# EasyEDA Pro project ProPrj_有源滤波器_2025-07-17.epro

# Schematic Schematic1
Board Name: Board1; Create Date: 2025-07-17; Page Name: P1; Project Name: 有源滤波器; Schematic Name: Schematic1; Update Date: 2025-07-17; Company: 嘉立创EDA; Page Size: A4; Version: V1.0
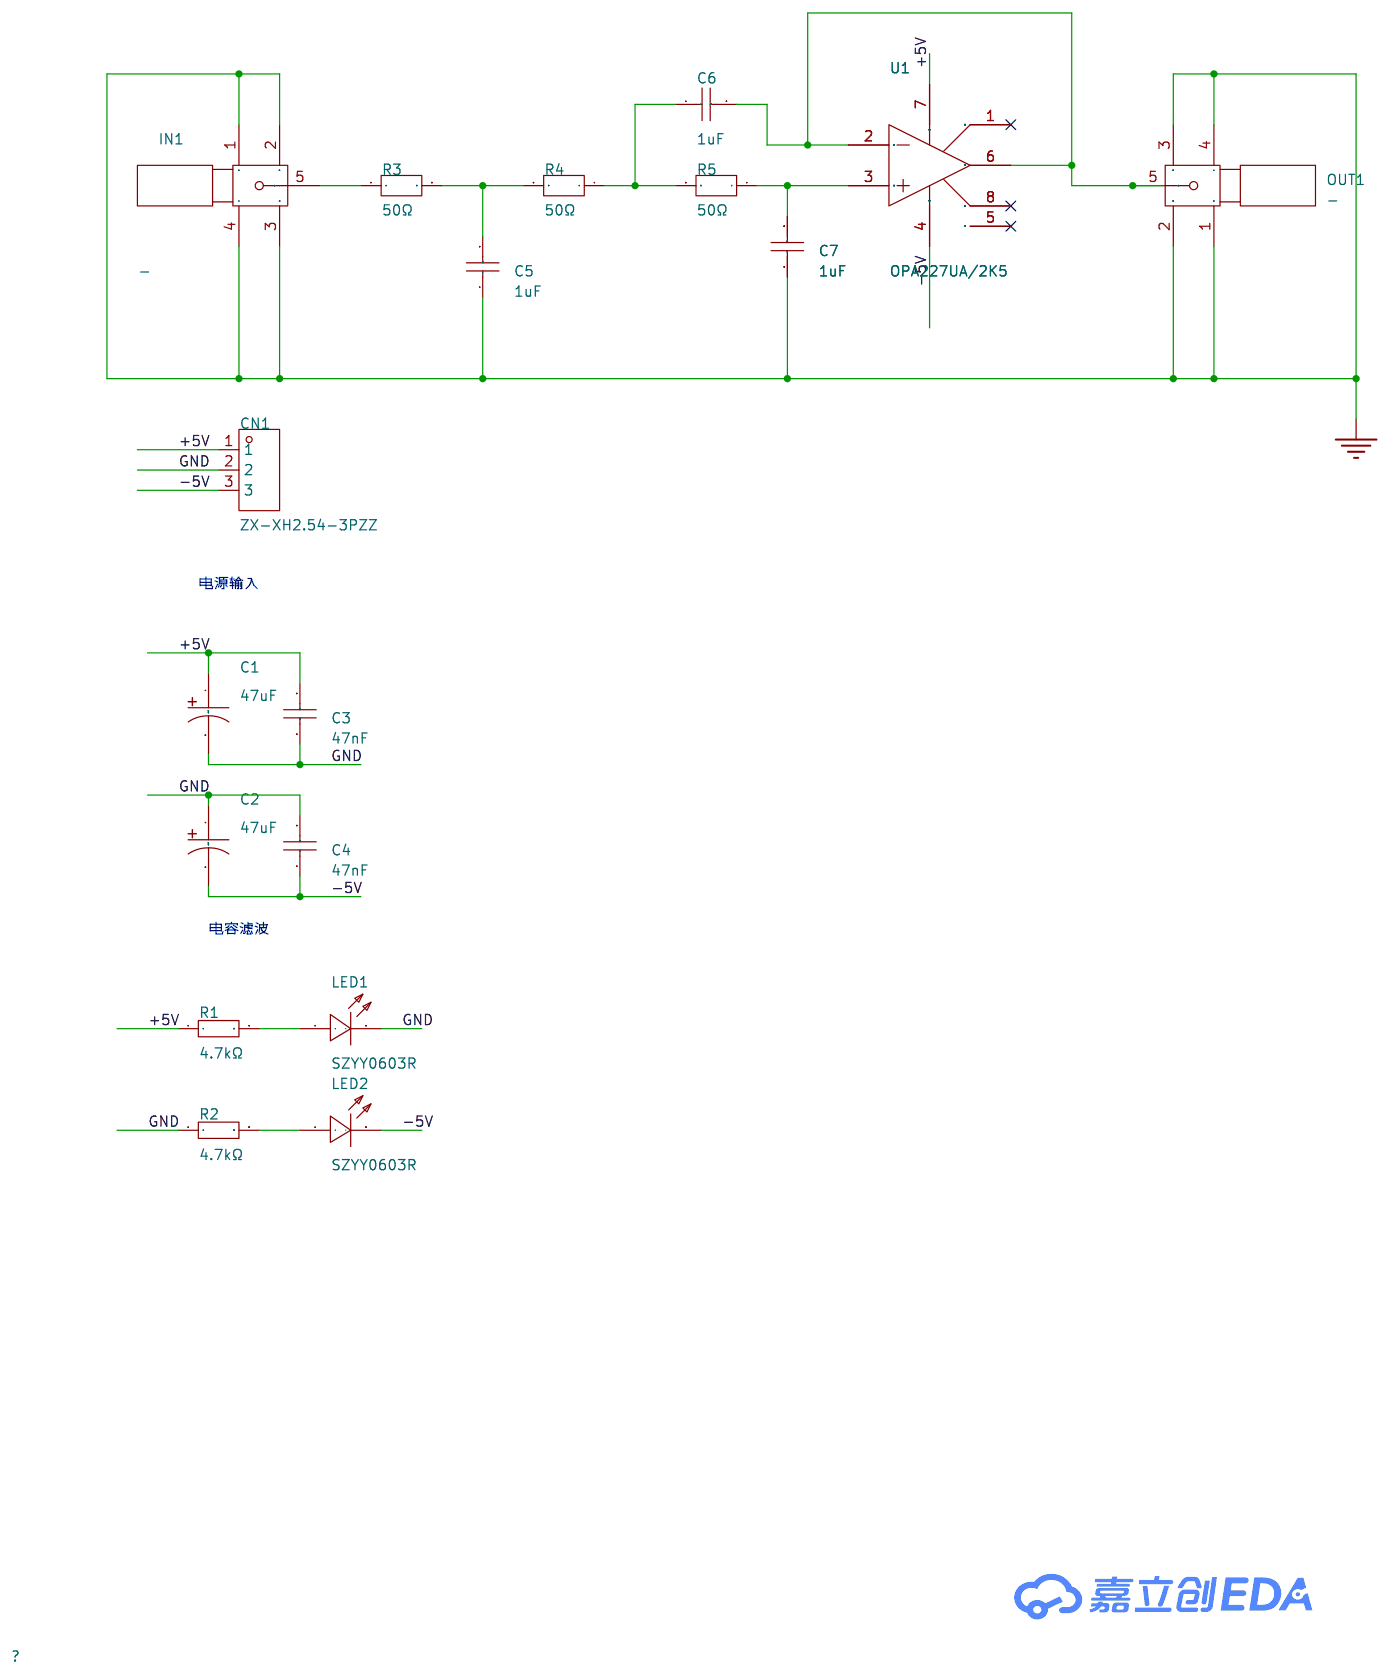
[diagram p0: schematic sheet]

## Parts
C1  47uF  [CAP-TH_BD5.0-P2.00-D0.8-FD]
C2  47uF  [CAP-TH_BD5.0-P2.00-D0.8-FD]
C3  47nF  [C0805]
C4  47nF  [C0805]
C5  1uF  [C0805]
C6  1uF  [C0805]
C7  1uF  [C0805]
CN1  ZX-XH2.54-3PZZ  [CONN-TH_3P-P2.54_2501S-3P]
IN1  -  [SMA-SMD_BWSMA-KE-P001]
LED1  SZYY0603R  [LED0603-R-RD]
LED2  SZYY0603R  [LED0603-R-RD]
OUT1  -  [SMA-SMD_BWSMA-KE-P001]
R1  4.7kΩ  [R0805]
R2  4.7kΩ  [R0805]
R3  50Ω  [R0805]
R4  50Ω  [R0805]
R5  50Ω  [R0805]
U1  OPA227UA/2K5  [SOIC-8_L4.9-W3.9-P1.27-LS6.0-BL]

## Library data of the parts
C1 C2 = NXB25V47M5*11 2.5TP: 容值:47uF;精度:±20%;额定电压:25V;纹波电流:250mA@100kHz;等效串联电阻(ESR):300mΩ@100kHz;; LCSC Part Name: 47uF ±20% 25V; Supplier Part: C371230; Manufacturer: SAMYOUNG(韩国三莹); Supplier Footprint: 插件,D5xL11mm; JLCPCB Part Class: 扩展库; Datasheet: https://atta.szlcsc.com/upload/public/pdf/source/20190227/C371244_FA85FFEFC2961227CF12E3CCE8C34A7D.pdf; Supplier: LCSC; Tolerance: ±20%; Voltage Rating: 25V; Ripple Current: 250mA@100kHz; Equivalent Series Resistance(ESR): 300mΩ@100kHz; Pin Spacing: 2mm; Diameter: 5mm; Height - Seated (Max): 11mm; Lifetime: 2000hrs@105℃; Operating Temperature: -40℃~+105℃
C3 C4 = CL21B473KBCNNNC: 容值:47nF;精度:±10%;额定电压:50V;材质(温度系数):X7R;; LCSC Part Name: 47nF ±10% 50V; Supplier Part: C53134; Manufacturer: SAMSUNG(三星); Supplier Footprint: 0805; JLCPCB Part Class: 基础库; Datasheet: https://atta.szlcsc.com/upload/public/pdf/source/20160218/1457707763339.pdf; Supplier: LCSC; Tolerance: ±10%; Voltage Rated: 50V; Temperature Coefficient: X7R
C5-C7 = CL21B105KBFNNNE: 容值:1uF;精度:±10%;额定电压:50V;材质(温度系数):X7R;; LCSC Part Name: 1uF ±10% 50V; Supplier Part: C28323; Manufacturer: SAMSUNG(三星); Supplier Footprint: 0805; JLCPCB Part Class: 基础库; Datasheet: https://atta.szlcsc.com/upload/public/pdf/source/20160218/1457707763339.pdf; Supplier: LCSC; Tolerance: ±10%; Voltage Rated: 50V; Temperature Coefficient: X7R
CN1 = ZX-XH2.54-3PZZ: 插针结构:1x3P;间距:2.5mm;安装方式:直插;参考系列:XH;总PIN数:3P;排数:1;每排PIN数:3;行距:-;额定电流:3A;触头材质:黄铜;触头镀层:锡;工作温度范围:-25℃~+85℃;; LCSC Part Name: 1x3P 间距:2.5mm 直插 系列:XH; Supplier Part: C7429633; Manufacturer: Megastar(兆星); Supplier Footprint: 插件,P=2.5mm; JLCPCB Part Class: 扩展库; Datasheet: https://atta.szlcsc.com/upload/public/pdf/source/20230619/AE17037A2CFDBE8D9CBA775D61AD0A84.pdf; Supplier: LCSC; Pins Structure: 1x3P; Pitch: 2.5mm; Mounting Type: 直插; Reference Series: XH; Number of Pins: 3P; Number of Rows: 1; Number of PINs Per Row: 3; Rated Current: 3A; Contact Material: 黄铜; Contact Plating: 锡; Operating Temperature: -25℃~+85℃; Rated Voltage (Max): 250V; Plastic Material: PA66; Flame Retardant Rating: UL94V-0; Color: 白色; Z-Height of the Board: 7mm; X-Length of Bottom Edge on Board (Spacing Line): 10mm; Y-Width of Bottom Edge on Board: 5.9mm
IN1 OUT1 = BWSMA-KE-P001: 连接器类型:板端;接口类型:内孔;端口数量:1;接口直径:5.2mm;接口长度/高度:-;频率:-;射频系列:SMA;阻抗:50Ω;样式:偏脚;工作温度:-;; LCSC Part Name: 内孔 SMA 偏脚; Supplier Part: C496550; Manufacturer: BAT WIRELESS(蝙蝠无线); Supplier Footprint: SMD; JLCPCB Part Class: 扩展库; Datasheet: https://atta.szlcsc.com/upload/public/pdf/source/20240320/28FD502871C976DFF213ABFCF2A0ED51.pdf; Supplier: LCSC; Connector Type: 板端; Interface: 内孔; Number of Ports: 1; Interface Diameter: 5.2mm; RF Series: SMA; Impedance: 50Ω; Style: 偏脚
LED1 LED2 = SZYY0603R: 发光颜色:红色;功率:40mW;正向电流:20mA;主波长:615nm~630nm;二极管配置:-;透镜颜色:无色透明透镜;色温:-;发光角度:120°;载带方式:-;工作温度:-40℃~+85℃;; LCSC Part Name: 红灯; Supplier Part: C434419; Manufacturer: yongyu(永裕光电); Supplier Footprint: 0603; JLCPCB Part Class: 扩展库; Datasheet: https://atta.szlcsc.com/upload/public/pdf/source/20191204/C434419_0B955C1F73FF88449D9A795B6FF49070.pdf; Supplier: LCSC; Emitted Color: 红色; Power Dissipation: 40mW; Forward Current: 20mA; Dominant Wavelength: 615nm~630nm; Peak Wavelength: 645nm; Lens Color: 无色透明透镜; Viewing Angle: 120°; Operating Temperature: -40℃~+85℃
R1 R2 = 0805W8F4701T5E: 电阻类型:厚膜电阻;阻值:4.7kΩ;精度:±1%;功率:125mW;最大工作电压:150V;温度系数:±100ppm/℃;; LCSC Part Name: 4.7kΩ ±1% 125mW 厚膜电阻; Supplier Part: C17673; Manufacturer: UNI-ROYAL(厚声); Supplier Footprint: 0805; JLCPCB Part Class: 基础库; Datasheet: https://atta.szlcsc.com/upload/public/pdf/source/20200306/C422600_1E6D84923E4A46A82E41ADD87F860B5C.pdf; Supplier: LCSC; Type: 厚膜电阻; Tolerance: ±1%; Power(Watts): 125mW; Overload Voltage (Max): 150V; Temperature Coefficient: ±100ppm/℃; Operating Temperature Range: -55℃~+155℃
R3-R5 = TD05G50R0BT: 电阻类型:薄膜电阻;阻值:50Ω;精度:±0.1%;功率:100mW;温度系数:±25ppm/℃;; LCSC Part Name: 薄膜电阻 50Ω ±0.1% 100mW; Supplier Part: C5355206; Manufacturer: FH(风华); Supplier Footprint: 0805; JLCPCB Part Class: 扩展库; Datasheet: https://atta.szlcsc.com/upload/public/pdf/source/20220726/97950D08E3EA8CC4F1F63A0C564F66E4.pdf; Supplier: LCSC; Type: 薄膜电阻; Tolerance: ±0.1%; Power(Watts): 100mW; Temperature Coefficient: ±25ppm/℃
U1 = OPA227UA/2K5: 放大器数:单路;增益带宽积(GBP):8MHz;输入偏置电流(Ib):2.5nA;压摆率(SR):2.3V/us;轨到轨:-;; Supplier Part: C456278; Manufacturer: TI(德州仪器); Supplier Footprint: SOIC-8; JLCPCB Part Class: 扩展库; Datasheet: https://www.ti.com/cn/lit/gpn/opa227; Supplier: LCSC; Number of Channels: 单路; Gain Bandwidth Product: 8MHz; Ib - Input Bias Current: 2.5nA; Slew Rate: 2.3V/us; Output Current: 45mA; Operating Temperature: -40℃~+85℃

## Nets
+5V: C1.1 C3.2 CN1.1 R1.1 U1.7(VCC)
-5V: C2.2 C4.1 CN1.3 LED2.2(-) U1.4(VSS)
GND: C1.2 C2.1 C3.1 C4.2 C5.1 C7.1 CN1.2 IN1.1 IN1.2 IN1.3 IN1.4 LED1.2(-) OUT1.1 OUT1.2 OUT1.3 OUT1.4 R2.1
$1N579: C5.2 R3.2 R4.2
$1N647: C6.1 R4.1 R5.2
$1N1236: LED1.1(+) R1.2
$1N1237: LED2.1(+) R2.2
Net-(C6-2): C6.2 OUT1.5 U1.2(VIN-) U1.6(OUT)
Net-(C7-2): C7.2 R5.1 U1.3(VIN+)
Net-(IN1-5): IN1.5 R3.1

Not connected (* = marked no-connect by the designer): U1 1(TRIM)* 5(NC)* 8(TRIM)*

## Notes on the sheet
- 电源输入
- 电容滤波

# Board PCB1
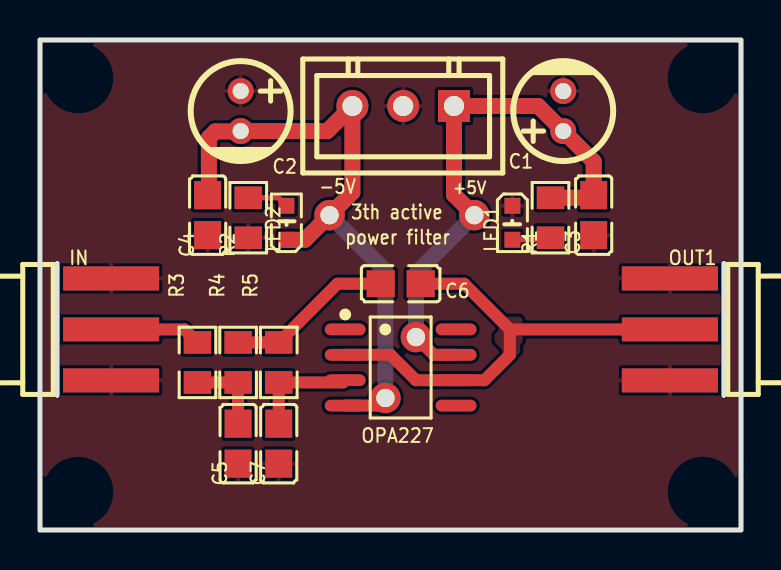
[diagram p1: board, top side]
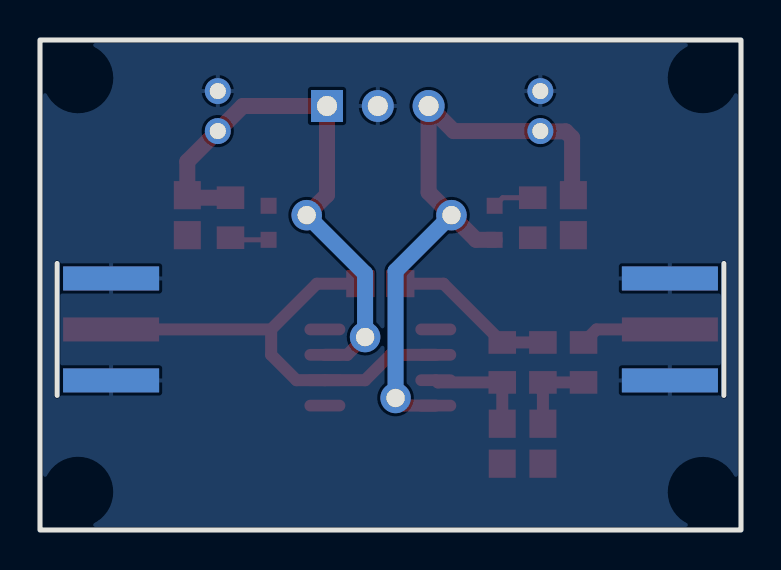
[diagram p2: board, bottom side, seen from below]

Outline 35.05 x 24.51 mm; copper layers: Top Layer, Bottom Layer. Coordinates in mm from the lower left corner of the outline.
Outline path: rectangle 0,24.51 35.05,0
Stack: Top Layer 0.035mm / Dielectric1 1.51mm FR4 er 4.5 / Bottom Layer 0.035mm

## Design rules (mm)
template: JLCPCB Capability(Two Layers Board)
spacing copperThickness1oz (default): track to track 0.102, other pairs 0.152 to 0.3
spacing copperThickness2oz: track to track 0.203, other pairs 0.152 to 0.3
track width copperThickness1oz (default): min 0.127, default 0.254, max 2.54
track width copperThickness2oz: min 0.203, default 0.254, max 2.54
differential pair differentialPair (default): width min 0.127, default 0.254, max 2.54; gap min 0.152, default 0.152
via viaSize (default): diameter min 0.5, default 0.61, max 10; hole min 0.3, default 0.305, max 6.3

## Placement (name value [footprint] x y rotation side)
+5V  ZX-XH2.54-3PZZ  [CONN-TH_3P-P2.54_2501S-3P]  18.16 21.21 180 top
C1  47uF  [CAP-TH_BD5.0-P2.00-D0.8-FD]  26.16 20.95 90 top
C2  47uF  [CAP-TH_BD5.0-P2.00-D0.8-FD]  10.03 20.95 270 top
C3  47nF  [C0805]  27.69 15.75 90 top
C4  47nF  [C0805]  8.38 15.75 270 top
C5  1uF  [C0805]  9.91 4.32 90 top
C6  1uF  [C0805]  18.03 12.32 0 top
C7  1uF  [C0805]  11.94 4.32 90 top
IN  -  [SMA-SMD_BWSMA-KE-P001]  3.56 10.03 180 top
LED1  SZYY0603R  [LED0603-R-RD]  23.62 15.37 270 top
LED2  SZYY0603R  [LED0603-R-RD]  12.32 15.37 90 top
NOREF  -  [Pad_e76]  17.27 6.6 0 top
NOREF#2  -  [Pad_e35]  14.48 15.75 0 top
NOREF#3  -  [Pad_e41]  21.72 15.75 0 top
NOREF#4  -  [Pad_e77]  18.8 9.65 0 top
OPA227  OPA227UA/2K5  [SOIC-8_L4.9-W3.9-P1.27-LS6.0-BL]  18.03 8.13 270 top
OUT1  -  [SMA-SMD_BWSMA-KE-P001]  31.5 10.03 0 top
R1  4.7kΩ  [R0805]  25.53 15.62 270 top
R2  4.7kΩ  [R0805]  10.41 15.62 90 top
R3  50Ω  [R0805]  7.87 8.38 270 top
R4  50Ω  [R0805]  9.91 8.38 270 top
R5  50Ω  [R0805]  11.94 8.38 90 top

## Footprints (pads in the part's own frame, mm; a bottom-side part is the same pattern mirrored in y, then rotated)
C0805
  rect 1.41x1.35 smd: 1(-1,0) 2(1,0)
CAP-TH_BD5.0-P2.00-D0.8-FD
  round 1.3 hole 0.8: 1(-1,0) 2(1,0)
CONN-TH_3P-P2.54_2501S-3P
  rect 1.6x1.6 hole 1: 1(-2.54,0)
  round 1.6 hole 1: 2(0,0) 3(2.54,0)
LED0603-R-RD
  rect 0.8x0.8 smd: 1(0.851,0) 2(-0.851,0)
Pad_e35
  round 1.524 hole 0.914: 1(0,0)
Pad_e41
  round 1.524 hole 0.914: 1(0,0)
Pad_e76
  round 1.524 hole 0.914: 1(0,0)
Pad_e77
  round 1.524 hole 0.914: 2(0,0)
R0805
  rect 1.133x1.377 smd: 1(-1,0) 2(1,0)
SMA-SMD_BWSMA-KE-P001
  rect 4.8x1.2 smd: 1(0,-2.55) 2(0,2.55) 5(0,0)
  rect 4.8x1.2 smd far side: 3(0,2.55) 4(0,-2.55)
SOIC-8_L4.9-W3.9-P1.27-LS6.0-BL
  oval 0.588x2.045 smd: 1(-1.905,-2.772) 2(-0.635,-2.772) 3(0.635,-2.772) 4(1.905,-2.772) 5(1.905,2.772) 6(0.635,2.772) 7(-0.635,2.772) 8(-1.905,2.772)

## Nets
+5V: +5V.1 C1.1 C3.2 NOREF#3.1 NOREF#4.2 OPA227.7 R1.1
-5V: +5V.3 C2.2 C4.1 LED2.2 NOREF.1 NOREF#2.1 OPA227.4
GND: +5V.2 C1.2 C2.1 C3.1 C4.2 C5.1 C7.1 IN.1 IN.2 IN.3 IN.4 LED1.2 OUT1.1 OUT1.2 OUT1.3 OUT1.4 R2.1
$1N533: IN.5 R3.1
$1N538: C6.2 OPA227.2 OPA227.6 OUT1.5
$1N579: C5.2 R3.2 R4.2
$1N647: C6.1 R4.1 R5.2
$1N662: C7.2 OPA227.3 R5.1
$1N1236: LED1.1 R1.2
$1N1237: LED2.1 R2.2

Pads without a net: OPA227 1 5 8

## Routing (per net, layer and track width the routed paths; a pad name or vN(x,y) marks a point on that pad's centre or on a via; arc(x,y) is an arc through that point)
+5V: length 27.6
  Top Layer w0.6: NOREF#4.2 19.69,8.76 OPA227.7
  Top Layer w0.8: NOREF#3.1 20.7,16.76 +5V.1 24.91,21.21 C1.1 27.69,18.43 C3.2 27.56,16.62 R1.1
  Bottom Layer w0.8: NOREF#3.1 18.8,12.83 NOREF#4.2
-5V: length 31.9
  Top Layer w0.6: NOREF.1 16.89,6.22 OPA227.4
  Top Layer w0.8: C4.1 8.45,16.81 8.45,19.62 8.76,19.94 10.02,19.94 C2.2 14.37,19.95 +5V.3 15.62,16.89 NOREF#2.1 13.25,14.52 LED2.2
  Bottom Layer w0.8: NOREF#2.1 17.27,12.95 17.27,6.73 17.4,6.6
$1N533: length 4.6
  Top Layer w0.6: R3.1 7.22,10.03 IN.5
$1N538: length 24
  Top Layer w0.6: 23.5,10.03 OUT1.5 ; 23.5,10.03 21.21,12.32 C6.2 ; 23.5,10.03 23.5,8.76 22.22,7.49 OPA227.6 18.8,7.49 17.53,8.76 OPA227.2
$1N579: length 4.1
  Top Layer w0.6: R3.2 R4.2 C5.2
$1N647: length 8.3
  Top Layer w0.6: R4.1 R5.2 14.88,12.32 C6.1
$1N662: length 5.4
  Top Layer w0.6: C7.2 R5.1 15.15,7.38 OPA227.3
$1N1236: length 1.9
  Top Layer w0.254: LED1.1 25.42,14.52 R1.2
$1N1237: length 2.1
  Top Layer w0.254: R2.2 11.92,16.62 LED2.1

## Copper pours and planes (outline as drawn; the poured copper is in the pictures)
GND on Top Layer: 0,24.51 35.05,24.51 35.05,0 0,0
GND on Bottom Layer: 0,24.51 35.05,24.51 35.05,0 0,0
$1N538 on Top Layer: 22.73,10.67 24.13,10.67 24.13,8.76 22.73,8.76

## Text on the board
Top Silkscreen Layer: -5V | power filter | 3th active
